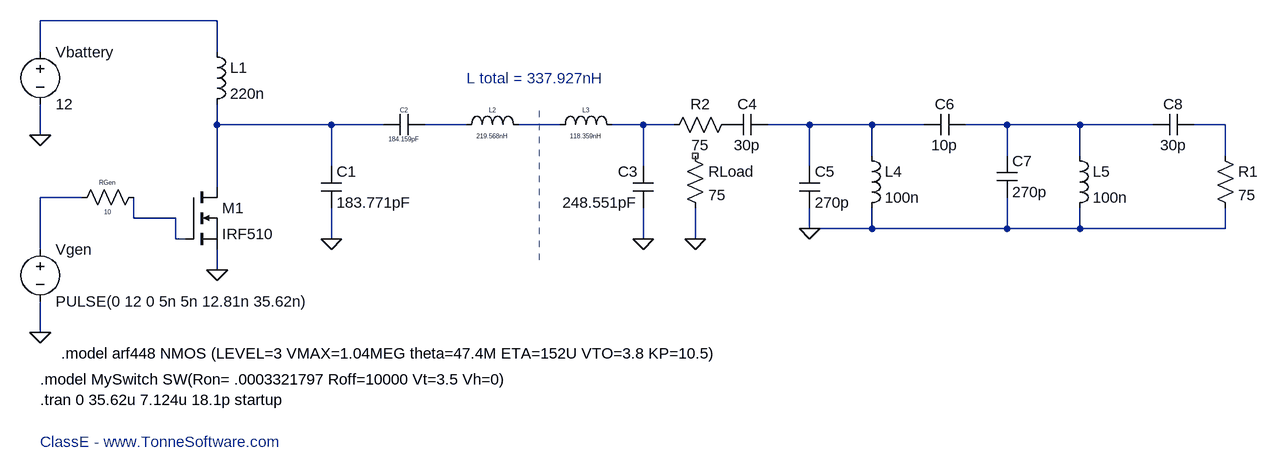
[diagram p0: schematic class_e_10mhz.asc]
class_e_10mhz.asc, the LTspice schematic file:
Version 4
SHEET 1 1880 392
WIRE 272 -272 0 -272
WIRE 0 -224 0 -272
WIRE 272 -224 272 -272
WIRE 272 -112 272 -144
WIRE 448 -112 272 -112
WIRE 528 -112 448 -112
WIRE 656 -112 592 -112
WIRE 800 -112 736 -112
WIRE 928 -112 880 -112
WIRE 976 -112 928 -112
WIRE 1184 -112 1120 -112
WIRE 1280 -112 1184 -112
WIRE 1360 -112 1280 -112
WIRE 1488 -112 1424 -112
WIRE 1600 -112 1488 -112
WIRE 1712 -112 1600 -112
WIRE 1824 -112 1776 -112
WIRE 0 -96 0 -144
WIRE 1280 -64 1280 -112
WIRE 1488 -64 1488 -112
WIRE 1600 -64 1600 -112
WIRE 1824 -64 1824 -112
WIRE 448 -48 448 -112
WIRE 928 -48 928 -112
WIRE 1184 -48 1184 -112
WIRE 272 -16 272 -112
WIRE 64 0 0 0
WIRE 144 32 144 0
WIRE 208 32 144 32
WIRE 1184 48 1184 16
WIRE 1280 48 1280 16
WIRE 1280 48 1184 48
WIRE 1488 48 1488 0
WIRE 1488 48 1280 48
WIRE 1600 48 1600 16
WIRE 1600 48 1488 48
WIRE 1824 48 1824 16
WIRE 1824 48 1600 48
WIRE 208 64 208 32
WIRE 224 64 208 64
WIRE 448 64 448 16
WIRE 928 64 928 16
WIRE 1008 64 1008 16
WIRE 0 80 0 0
WIRE 272 112 272 80
WIRE 0 208 0 160
FLAG 0 208 0
FLAG 272 112 0
FLAG 0 -96 0
FLAG 448 64 0
FLAG 928 64 0
FLAG 1008 64 0
FLAG 1184 48 0
SYMBOL voltage 0 -240 R0
WINDOW 123 24 132 Left 0
SYMATTR InstName Vbattery
SYMATTR Value 12
SYMBOL voltage 0 64 R0
WINDOW 123 24 132 Left 0
WINDOW 39 0 0 Left 0
SYMATTR InstName Vgen
SYMATTR Value PULSE(0 12 0 5n 5n 12.81n 35.62n)
SYMBOL res 160 -16 R90
WINDOW 0 0 56 VBottom 0
WINDOW 3 32 56 VTop 0
SYMATTR InstName RGen
SYMATTR Value 10
SYMBOL ind 256 -240 R0
SYMATTR InstName L1
SYMATTR Value 220n
SYMBOL cap 432 -48 R0
SYMATTR InstName C1
SYMATTR Value 183.771pF
SYMBOL cap 592 -128 R90
WINDOW 0 0 32 VBottom 0
WINDOW 3 32 32 VTop 0
SYMATTR InstName C2
SYMATTR Value 184.159pF
SYMBOL ind 640 -96 R270
WINDOW 0 32 56 VTop 0
WINDOW 3 5 56 VBottom 0
SYMATTR InstName L2
SYMATTR Value 219.568nH
SYMBOL ind 784 -96 R270
WINDOW 0 32 56 VTop 0
WINDOW 3 5 56 VBottom 0
SYMATTR InstName L3
SYMATTR Value 118.359nH
SYMBOL cap 944 -48 M0
SYMATTR InstName C3
SYMATTR Value 248.551pF
SYMBOL res 992 -80 R0
SYMATTR InstName RLoad
SYMATTR Value 75
SYMBOL cap 1120 -128 R90
WINDOW 0 0 32 VBottom 2
WINDOW 3 32 32 VTop 2
SYMATTR InstName C4
SYMATTR Value 30p
SYMBOL cap 1168 -48 R0
SYMATTR InstName C5
SYMATTR Value 270p
SYMBOL ind 1264 -80 R0
SYMATTR InstName L4
SYMATTR Value 100n
SYMBOL cap 1424 -128 R90
WINDOW 0 0 32 VBottom 2
WINDOW 3 32 32 VTop 2
SYMATTR InstName C6
SYMATTR Value 10p
SYMBOL cap 1472 -64 R0
SYMATTR InstName C7
SYMATTR Value 270p
SYMBOL ind 1584 -80 R0
SYMATTR InstName L5
SYMATTR Value 100n
SYMBOL cap 1776 -128 R90
WINDOW 0 0 32 VBottom 2
WINDOW 3 32 32 VTop 2
SYMATTR InstName C8
SYMATTR Value 30p
SYMBOL res 1808 -80 R0
SYMATTR InstName R1
SYMATTR Value 75
SYMBOL nmos 224 -16 R0
SYMATTR InstName M1
SYMATTR Value IRF510
SYMBOL res 1072 -128 R90
WINDOW 0 0 56 VBottom 2
WINDOW 3 32 56 VTop 2
SYMATTR InstName R2
SYMATTR Value 75
TEXT 0 280 Left 2 !.model MySwitch SW(Ron= .0003321797 Roff=10000 Vt=3.5 Vh=0)
TEXT 0 312 Left 2 !.tran 0 35.62u 7.124u 18.1p startup
TEXT 0 376 Left 2 ;ClassE - www.TonneSoftware.com
TEXT 656 -184 Left 2 ;L total = 337.927nH
TEXT 32 240 Left 2 !.model arf448 NMOS (LEVEL=3 VMAX=1.04MEG theta=47.4M ETA=152U VTO=3.8 KP=10.5)
LINE Normal 768 96 768 -144 2

The netlist it stands for:
* class_e_10mhz.asc
Vbattery N001 0 12
Vgen N009 0 PULSE(0 12 0 5n 5n 12.81n 35.62n)
RGen N010 N009 10
L1 N001 N002 220n
C1 N002 0 183.771pF
C2 N003 N002 184.159pF
L2 N003 N004 219.568nH
L3 N004 N005 118.359nH
C3 N005 0 248.551pF
RLoad NC_01 0 75
C4 N006 P001 30p
C5 N006 0 270p
L4 N006 0 100n
C6 N007 N006 10p
C7 N007 0 270p
L5 N007 0 100n
C8 N008 N007 30p
R1 N008 0 75
M1 N002 N010 0 0 IRF510
R2 P001 N005 75
.model NMOS NMOS
.model PMOS PMOS
.lib standard.mos
.model MySwitch SW(Ron= .0003321797 Roff=10000 Vt=3.5 Vh=0)
.tran 0 35.62u 7.124u 18.1p startup
* ClassE - www.TonneSoftware.com
* L total = 337.927nH
.model arf448 NMOS (LEVEL=3 VMAX=1.04MEG theta=47.4M ETA=152U VTO=3.8 KP=10.5)
.backanno
.end